# EAGLE schematic 555 (EAGLE 8.6.0)
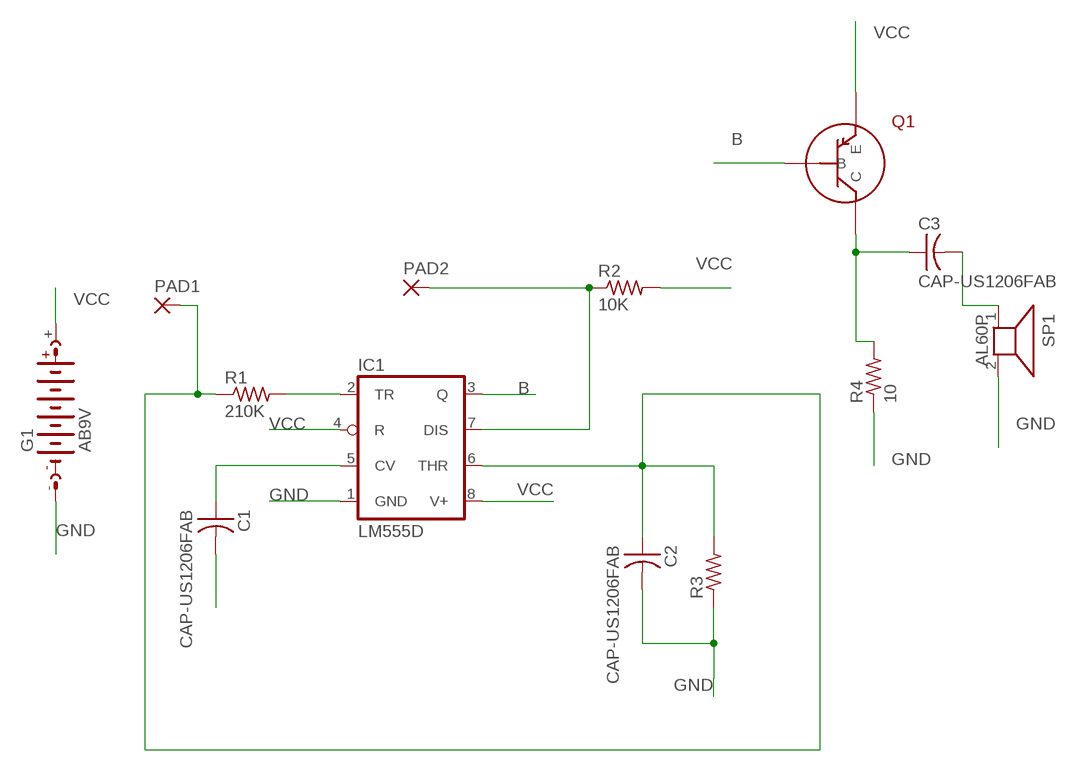
[diagram p0: schematic, sheet 1]

## Parts
C1  CAP-US1206FAB  [C1206FAB]
C2  CAP-US1206FAB  [C1206FAB]
C3  CAP-US1206FAB  [C1206FAB]
G1  AB9V  [AB9V]
IC1  LM555D  [SO08]
PAD1  1,6/0,8  [1,6/0,8]
PAD2  1,6/0,8  [1,6/0,8]
Q1  BJT_PNP  (no package)
R1  210K  RES-US1206FAB  [R1206FAB]
R2  10K  RES-US1206FAB  [R1206FAB]
R3  RES-US1206FAB  [R1206FAB]
R4  10  RES-US1206FAB  [R1206FAB]
SP1  AL60P  [AL60P]

## Nets
B: IC1.3(Q) Q1.B
GND: C1.2 C2.2 G1.- IC1.1(GND) R3.1 R4.1 SP1.2
N$1: IC1.2(TR) R1.2
N$2: C2.1 IC1.6(THR) PAD1.1(P) R1.1 R3.2
N$3: IC1.7(DIS) PAD2.1(P) R2.1
N$4: C1.1 IC1.5(CV)
N$5: C3.1 Q1.C R4.2
N$6: C3.2 SP1.1
VCC: G1.+ IC1.4(R) IC1.8(V+) Q1.E R2.2

## Library data of the parts
C1-C3 = fab:CAP-US
G1 = battery:AB9V: 9-V BATTERY CLIP
IC1 = linear:*555: TIMER
PAD1 PAD2 = wirepad:1,6/0,8: THROUGH-HOLE PAD
Q1 = ngspice-simulation:BJT_PNP: Bipolar PNP Transistor
R1-R4 = fab:RES-US: Resistor (US Symbol) Variants with postfix FAB are widened to allow the routing of internal traces
SP1 = buzzer:AL60P: SPEAKER Source: Buerklin; OC_FARNELL: unknown; OC_NEWARK: unknown